# Altium schematic sheet RFID Reader Coversheet.SchDoc
size A3; SHEET_TITLE: RFID Reader; SheetNumber: 1; SheetTotal: 8; SHEET_LYR_NAME: Cover Sheet; Application_BuildNumber: 1
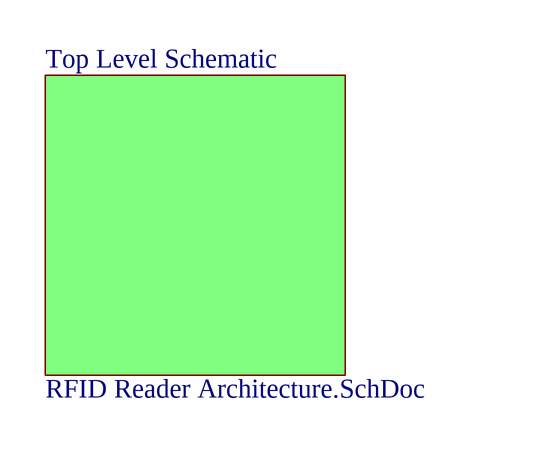
[diagram p0: RFID Reader Coversheet.SchDoc]

## Parts
?  (no value)  (graphical)

## Sub-sheets
Top Level Schematic = RFID Reader Architecture.SchDoc: no entries

## Notes on the sheet
- LAYER NAME
- CRITICAL QUALITY ATTRIBUTE
- TITLE NAME
- THIS DRAWING CONTAINS CONFIDENTIAL INFORMATION AND IS ISSUED IN CONFIDENCE ON THE CONDITIONS
  THAT IT BE RETURNED ON DEMAND AND NOT BE COPIED, REPRODUCED, DISCLOSED TO OTHERS OR USED
  IN THE MANUFACTURE OF THE SUBJECT-MATTER THEREOF WITHOUT THE WRITTEN CONSENT OF
  STRYKER CORPORATION.
- SHALL BE COMPLIANT PER ES-1168 AND ES-1005
- SHEET
- OF
- NUMBER
- REV
- APPROVALS ARE FOUND IN PLM SYSTEM

## Library data of the parts
? = CMP-001-0000-v0.01.17: Stryker standard title block with pre-parameterized fields